# Altium schematic sheet UART_Multiplexor.SchDoc
size Letter
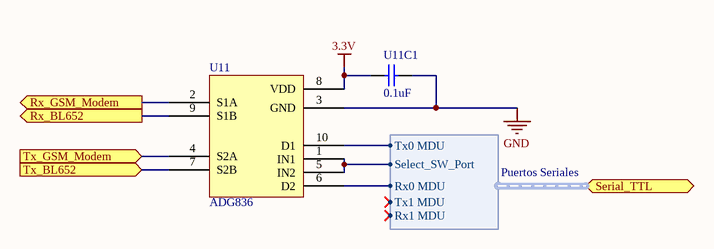
[diagram p0: UART_Multiplexor.SchDoc]

## Parts
U11  ADG836  [ADG836]
U11C1  0.1uF  [0603 - CAP]

## Ports
Rx_BL652 (out), Rx_GSM_Modem (out), Serial_TTL (harness Puertos Seriales), Tx_BL652 (in), Tx_GSM_Modem (in)

## Harnesses
Puertos Seriales: Select_SW_Port, Tx0 MDU, Rx1 MDU, Rx0 MDU, Tx1 MDU

## Nets
3.3V: U11.8(VDD) U11C1.2
GND: U11.3(GND) U11C1.1
Rx_BL652: U11.9(S1B) ; port Rx_BL652
Rx_GSM_Modem: U11.2(S1A) ; port Rx_GSM_Modem
Tx_BL652: U11.7(S2B) ; port Tx_BL652
Tx_GSM_Modem: U11.4(S2A) ; port Tx_GSM_Modem
NetU11_1: U11.1(IN1) U11.5(IN2) ; port Serial_TTL.Select_SW_Port
NetU11_6: U11.6(D2) ; port Serial_TTL.Rx0 MDU
NetU11_10: U11.10(D1) ; port Serial_TTL.Tx0 MDU

## Notes on the sheet
- Elaboró
- Fecha
- Nombre del artículo
- Revisó
- Aprobó
- Número de parte
- Revisión
- Escala
- N/A
- Sección afectada
- Descripción del cambio
- Lámina
- 1/1
- Tolerancias
- Ruta del archivo

## Library data of the parts
U11 = ADG836: IC SWITCH DUAL SPDT 10MSOP; Manufacturer: Analog Devices Inc.; Manufacturer Part Number: ADG836YRMZ; Supplier 1: Digi-Key; Supplier Part Number 1: ADG836YRMZ-ND
U11C1 = Cap: CAP CERAMIC 0.1UF, 25V, X7R, 0603; Manufacturer Part Number: CGJ3E2X7R1E104K080AA; Manufacturer: TDK Corporation; Value: 0.1uF; Supplier 1: Digi-Key; Supplier Part Number 1: 445-8129-1-ND